# Altium schematic sheet MAIN.SchDoc
size A3; Organization: Electronic Research & Design; Address1: 11 Granofier; Address2: Zwartkop; Address3: Centurion; Address4: South Africa; Revision: 1; SheetNumber: 1; SheetTotal: 1; ProjectName: Flir
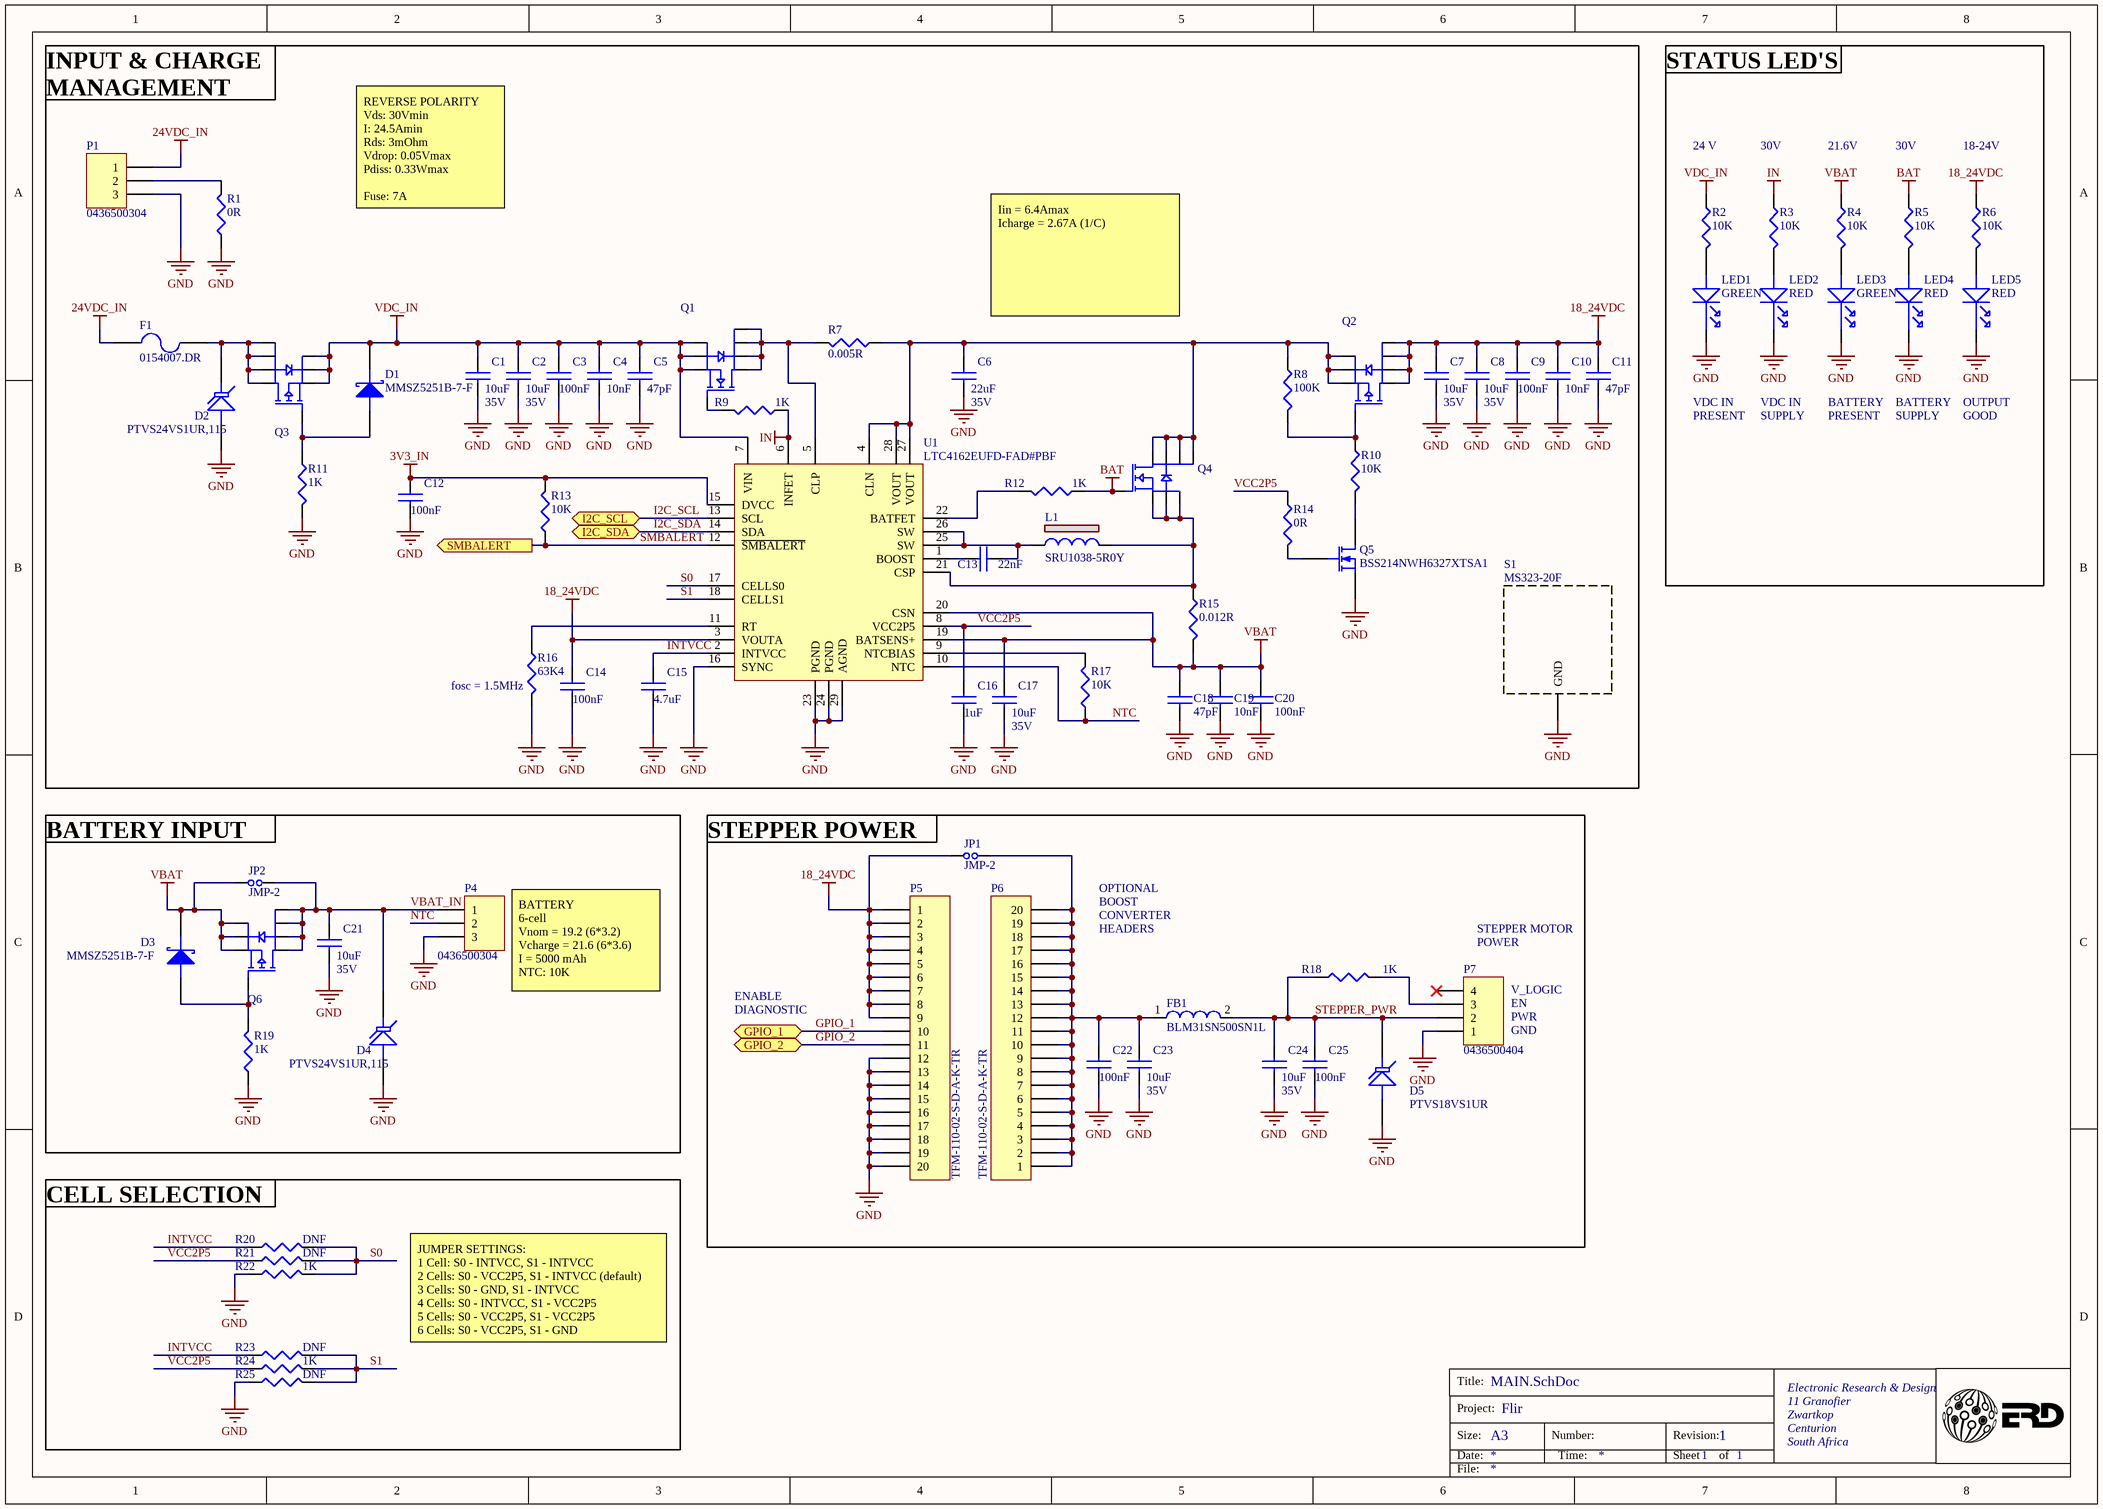
[diagram p0: MAIN.SchDoc]

## Parts
C1  10uF  Voltage Rating: 35V  [CC0805]
C2  10uF  Voltage Rating: 35V  [CC0805]
C3  100nF  [CC0402]
C4  10nF  [CC0402]
C5  47pF  [CC0402]
C6  22uF  Voltage Rating: 35V  [RC1206]
C7  10uF  Voltage Rating: 35V  [CC0805]
C8  10uF  Voltage Rating: 35V  [CC0805]
C9  100nF  [CC0402]
C10  10nF  [CC0402]
C11  47pF  [CC0402]
C12  100nF  [CC0402]
C13  22nF  [CC0402]
C14  100nF  [CC0402]
C15  4.7uF  [CC0603]
C16  1uF  [CC0402]
C17  10uF  Voltage Rating: 35V  [CC0805]
C18  47pF  [CC0402]
C19  10nF  [CC0402]
C20  100nF  [CC0402]
C21  10uF  Voltage Rating: 35V  [CC0805]
C22  100nF  [CC0402]
C23  10uF  Voltage Rating: 35V  [CC0805]
C24  10uF  Voltage Rating: 35V  [CC0805]
C25  100nF  [CC0402]
D1  MMSZ5251B-7-F  [SOD123W]
D2  PTVS24VS1UR,115  [SOD123W]
D3  MMSZ5251B-7-F  [SOD123W]
D4  PTVS24VS1UR,115  [SOD123W]
D5  PTVS18VS1UR  [SOD123W]
F1  0154007.DR  [OMNI_BLOK]
FB1  BLM31SN500SN1L  [RC1206]
JP1  JMP-2
JP2  JMP-2
L1  SRU1038-5R0Y  [MSS1260]
LED1  GREEN  [LED0603]
LED2  RED  [LED0603]
LED3  GREEN  [LED0603]
LED4  RED  [LED0603]
LED5  RED  [LED0603]
P1  0436500304  [HDR1X3]
P4  0436500304  [HDR1X3]
P5  TFM-110-02-S-D-A-K-TR  [HDR1X20]
P6  TFM-110-02-S-D-A-K-TR  [HDR1X20]
P7  0436500404  [HDR1X4]
Q1  BSC054N04NSGATMA1  [PG-TDSON-8 - alternate]  (value not drawn)
Q2  BSC030P03NS3GAUMA1  [PG-TDSON-8 - alternate]  (value not drawn)
Q3  BSC030P03NS3GAUMA1  [PG-TDSON-8 - alternate]  (value not drawn)
Q4  BSC054N04NSGATMA1  [PG-TDSON-8 - alternate]  (value not drawn)
Q5  BSS214NWH6327XTSA1  [SOT323]
Q6  BSC030P03NS3GAUMA1  [PG-TDSON-8 - alternate]  (value not drawn)
R1  0R  [RC0402]
R2  10K  [RC0402]
R3  10K  [RC0402]
R4  10K  [RC0402]
R5  10K  [RC0402]
R6  10K  [RC0402]
R7  0.005R  [RC1206W]
R8  100K  [RC0402]
R9  1K  [RC0402]
R10  10K  [RC0402]
R11  1K  [RC0402]
R12  1K  [RC0402]
R13  10K  [RC0402]
R14  0R  [RC0402]
R15  0.012R  [RC1206]
R16  63K4  [RC0402]
R17  10K  [RC0402]
R18  1K  [RC0402]
R19  1K  [RC0402]
R20  DNF  [RC0402]
R21  DNF  [RC0402]
R22  1K  [RC0402]
R23  DNF  [RC0402]
R24  1K  [RC0402]
R25  DNF  [RC0402]
S1  MS323-20F  [2118727-2]
U1  LTC4162EUFD-FAD#PBF  [QFN-28 LTC]

## Blocks framed on the sheet
fosc = 1.5MHz: C1-C20 D1 D2 F1 L1 P1 Q1-Q5 R1 R7-R17 S1 U1

## Ports
GPIO_1 (bidir), GPIO_2 (bidir), I2C_SCL (bidir), I2C_SDA (bidir), SMBALERT (out)

## Nets
3V3_IN: C12.1 R13.2 U1.15(DVCC)
18_24VDC: C7.1 C8.1 C9.1 C10.1 C11.1 C14.1 JP1.1 P5.1 P5.2 P5.3 P5.4 P5.5 P5.6 P5.7 P5.8 P5.9 Q2.5(DRAIN) Q2.6(DRAIN) Q2.7(DRAIN) Q2.8(DRAIN) R6.1 U1.3(VOUTA)
24VDC_IN: F1.1 P1.1
BAT: Q4.4(G) R5.1 R12.2
GND: C1.2 C2.2 C3.2 C4.2 C5.2 C6.2 C7.2 C8.2 C9.2 C10.2 C11.2 C12.2 C14.2 C15.2 C16.2 C17.2 C18.2 C19.2 C20.2 C21.2 C22.2 C23.2 C24.2 C25.2 D2.2 D4.2 D5.2 LED1.C LED2.C LED3.C LED4.C LED5.C P1.3 P4.3 P5.12 P5.13 P5.14 P5.15 P5.16 P5.17 P5.18 P5.19 P5.20 P7.1 Q5.3(S) R1.1 R11.2 R16.2 R19.2 R22.1 R25.1 S1.1(GND) U1.16(SYNC) U1.23(PGND) U1.24(PGND) U1.29(AGND)
IN: R3.1 R9.2 U1.6(INFET)
VBAT: C17.1 C18.1 C19.1 C20.1 D3.1 JP2.1 Q6.1(SOURCE) Q6.2(SOURCE) Q6.3(SOURCE) R4.1 R15.2 U1.19(BATSENS+) U1.20(CSN)
VDC_IN: C1.1 C2.1 C3.1 C4.1 C5.1 D1.1 Q1.1(S) Q1.2(S) Q1.3(S) Q3.1(SOURCE) Q3.2(SOURCE) Q3.3(SOURCE) R2.1 U1.7(VIN)
GPIO_1: P5.10 ; port GPIO_1
GPIO_2: P5.11 ; port GPIO_2
I2C_SCL: U1.13(SCL) ; port I2C_SCL
I2C_SDA: U1.14(SDA) ; port I2C_SDA
INTVCC: C15.1 R20.1 R23.1 U1.2(INTVCC)
NTC: P4.2 R17.1 U1.10(NTC)
S0: R20.2 R21.2 R22.2 U1.17(CELLS0)
S1: R23.2 R24.2 R25.2 U1.18(CELLS1)
SMBALERT: R13.1 U1.12(~{SMBALERT}) ; port SMBALERT
STEPPER_PWR: C24.1 C25.1 D5.1 FB1.2 P7.2 R18.1
VBAT_IN: C21.1 D4.1 JP2.2 P4.1 Q6.5(DRAIN) Q6.6(DRAIN) Q6.7(DRAIN) Q6.8(DRAIN)
VCC2P5: C16.1 R14.1 R21.1 R24.1 U1.8(VCC2P5)
NetC6_1: C6.1 Q2.1(SOURCE) Q2.2(SOURCE) Q2.3(SOURCE) Q4.5(D) Q4.6(D) Q4.7(D) Q4.8(D) R7.1 R8.1 U1.4(CLN) U1.27(VOUT) U1.28(VOUT)
NetC13_1: C13.1 U1.1(BOOST)
NetC13_2: C13.2 L1.1 U1.25(SW) U1.26(SW)
NetC22_1: C22.1 C23.1 FB1.1 JP1.2 P6.1 P6.2 P6.3 P6.4 P6.5 P6.6 P6.7 P6.8 P6.9 P6.10 P6.11 P6.12 P6.13 P6.14 P6.15 P6.16 P6.17 P6.18 P6.19 P6.20
NetD1_2: D1.2 Q3.4(GATE) R11.1
NetD2_1: D2.1 F1.2 Q3.5(DRAIN) Q3.6(DRAIN) Q3.7(DRAIN) Q3.8(DRAIN)
NetD3_2: D3.2 Q6.4(GATE) R19.1
NetL1_2: L1.2 Q4.1(S) Q4.2(S) Q4.3(S) R15.1 U1.21(CSP)
NetLED1_A: LED1.A R2.2
NetLED2_A: LED2.A R3.2
NetLED3_A: LED3.A R4.2
NetLED4_A: LED4.A R5.2
NetLED5_A: LED5.A R6.2
NetP1_2: P1.2 R1.2
NetP7_3: P7.3 R18.2
NetQ1_4: Q1.4(G) R9.1
NetQ1_5: Q1.5(D) Q1.6(D) Q1.7(D) Q1.8(D) R7.2 U1.5(CLP)
NetQ2_4: Q2.4(GATE) R8.2 R10.1
NetQ5_1: Q5.1(D) R10.2
NetQ5_2: Q5.2(G) R14.2
NetR12_1: R12.1 U1.22(BATFET)
NetR16_1: R16.1 U1.11(RT)
NetR17_2: R17.2 U1.9(NTCBIAS)

Not connected (* = marked no-connect by the designer): P7 4*

## Notes on the sheet
- INPUT & CHARGE MANAGEMENT
- STATUS LED'S
- 24 V
- 30V
- 21.6V
- 18-24V
- REVERSE POLARITY
  Vds: 30Vmin
  I: 24.5Amin
  Rds: 3mOhm
  Vdrop: 0.05Vmax
  Pdiss: 0.33Wmax
  Fuse: 7A
- Iin = 6.4Amax
  Icharge = 2.67A (1/C)
- VDC IN
- PRESENT
- SUPPLY
- BATTERY
- OUTPUT
- GOOD
- (near JP2) BATTERY INPUT
- (near JP1) STEPPER POWER
- OPTIONAL
- BOOST
- CONVERTER
- (near P4) BATTERY
  6-cell
  Vnom = 19.2 (6*3.2)
  Vcharge = 21.6 (6*3.6)
  I = 5000 mAh
  NTC: 10K
- HEADERS
- (near P7) POWER
- STEPPER MOTOR
- (near P7) V_LOGIC
- ENABLE
- DIAGNOSTIC
- (near P7) GND
- (near P7) PWR
- (near P7) EN
- CELL SELECTION
- JUMPER SETTINGS:
  1 Cell: S0 - INTVCC, S1 - INTVCC
  2 Cells: S0 - VCC2P5, S1 - INTVCC (default)
  3 Cells: S0 - GND, S1 - INTVCC
  4 Cells: S0 - INTVCC, S1 - VCC2P5
  5 Cells: S0 - VCC2P5, S1 - VCC2P5
  6 Cells: S0 - VCC2P5, S1 - GND
- Title:
- Size:
- Date:
- Project:
- A3
- Number:
- Time:
- Revision:
- Sheet
- of
- File:

## Library data of the parts
C1 C2 C7 C8 C17 C21 C23 C24 = CAP CER 0.1UF 10V 10% X5R 0402: CAP CER 10UF 35V 10% X5R 0805; Manufacturer: Murata; Part Number: GRM21BR6YA106KE43L; Package / Case: 0805
C3 C9 C12 C14 C20 C22 C25 = CAP CER 0.1UF 10V 10% X5R 0402: CAP CER 0.1UF 50V 10% X7R 0402; Manufacturer: Murata; Part Number: GCM155R71H104KE02D; Package / Case: 0402 (1005 Metric); Supplier: AAD
C4 C10 C19 = CAP CER 0.1UF 10V 10% X5R 0402: CAP CER 10NF 50V 10% X7R 0402; Manufacturer: Murata; Part Number: GRM155R71H103KA88J; Package / Case: 0402; Voltage Rating: 50V
C5 C11 C18 = CAP CER 0.1UF 10V 10% X5R 0402: CAP CER 47PF 50V 5% C0G/NP0 0402; Manufacturer: Murata; Part Number: GCM1555C1H470JA16D; Package / Case: 0402; Voltage Rating: 50V
C6 = CAP CER 0.1UF 10V 10% X5R 0402: CAP CER 22UF 35V 20% X5R 1206; Manufacturer: Murata; Part Number: C3216X5R1V226M160AC; Package / Case: 1206
C13 = CAP CER 0.1UF 10V 10% X5R 0402: CAP CER 0.022UF 50V 10% X7R 0402; Manufacturer: Murata; Part Number: GCM155R71H223KA55D; Package / Case: 0402 (1005 Metric); Supplier: AAD
C15 = CAP CER 0.1UF 10V 10% X5R 0402: CAP CER 4.7UF 25V 10% X5R 0603; Manufacturer: Murata; Part Number: GRM188R61E475KE11D; Package / Case: 0603; Supplier: AAD
C16 = CAP CER 0.1UF 10V 10% X5R 0402: CAP CER 1UF 10V 20% X5R 0402; Manufacturer: Murata; Part Number: GRM153R61A105ME95D; Package / Case: 0402 (1005 Metric); Supplier: AAD
D1 D3 = DIODE SCHOTTKY: DIODE, ZENER, 22V, 5%, 500mW, SOD123; PartNumber: MMSZ5251B-7-F
D2 D4 = Tranzorb: DIODE, TVS, 24V, 400W, SOD123W; PartNumber: PTVS24VS1UR,115
D5 = Tranzorb: DIODE, TVS, 24V, 400W, SOD123W; PartNumber: PTVS24VS1UR,115
F1 = Fuse 2: FUSE, OMNIBLOK, 125VAC/DC, 7A, Fast, SMD; Manufacturer: Littlefuse; Replacement Fuse: 0451007.MRL; PartNUmber: 0154007.DR
FB1 = FER_180_200_0: FERRITE, 12A, 1.6mOhm, 1206; PartNumber: BLM31SN500SN1L
JP1 JP2 = JMP-2: Solder Jumper 2 pin
L1 = MSS1260X: IND, Power, Shielded, 5uH, 4.8A Isat, 14.5 mOHM, SMD; Manufacturer: Bourns; PartNumber: SRU1038-5R0Y
LED1 LED3 = LED: LED, GRN, 65 mcd, 0603; PartNumber: LTST-C194KGKT; Color: GREEN
LED2 LED4 LED5 = LED: LED, GRN, 65 mcd, 0603; PartNumber: LTST-C194KRKT; Color: RED
P1 P4 = Header 3: Header, MicroFit, RA, 3-circuit, 3mm pitch, TH; Manufacturer: Molex; Mating Part: 0436450300; PartNumber: 0436500304
P5 P6 = Header 20: Header, 20 POS, 1.27mm PITCH, SMD; PartNumber: TFM-110-02-S-D-A-K-TR
P7 = Header 4: Header, MicroFit, RA, 4-circuit, 3mm pitch, TH; Manufacturer: Molex; Mating Part: 0436450400; PartNumber: 0436500404
Q1 Q4 = BSC190N15NS3: N-channel FET, 40V, 17A, 5.4mOhm, TDSON-8; pin to pad: 8>8+9; Part Number: BSC054N04NSGATMA1
Q2 Q3 Q6 = p_Channel: P-channel FET, 30V, 100A, 3mOhm, TDSON-8; Part Number: BSC030P03NS3GAUMA1
Q5 = MOSFET-N: N-Channel FET, 20V, 1.5A, 140mOhm, SOT323; pin to pad: 1>3 2>1 3>2; Published: 8-Jun-2000; LatestRevisionDate: 17-Jul-2002; LatestRevisionNote: Re-released for DXP Platform.; PackageVersion: 1995/1996; PackageReference: E3; Publisher: Altium Limited; PackageDescription: TO, Flat Index; 3 In-Line, Axial Leads; Body Dia. 4.6mm; Lead Dia. 0.5 mm (max); Part Number: BSS214NWH6327XTSA1
R1 R14 = RES_10K_1/16W_1%_0402: RES, 0 OHM, 1/16W, 1%, 0402; Manufacturer: Yageo; PartNumber: RC0402FR-070RL; Package / Case: 0402 (1005 Metric); Supplier: AAD
R2-R6 R10 R13 R17 = RES_10K_1/16W_1%_0402: RES, 10K OHM, 1/16W, 1%, 0402; Manufacturer: Yageo; Part Number: RC0402FR-0710KL; Package / Case: 0402 (1005 Metric); Supplier: AAD
R7 = RES_0_1/16W_1%_0402: RES, 0.005 OHM, 1W, 1%, 1206W; Manufacturer: Susumu; Manufacturer Part Number: KRL3216T4A-M-R005-F-T1; Package / Case: 1206 (3216 Metric); Supplier: DigiKey; Supplier Stock Code: 408-1969-2-ND; PartNumber: KRL3216T4A-M-R005-F-T1
R8 = RES_10K_1/16W_1%_0402: RES, 100K OHM, 1/16W, 1%, 0402; Manufacturer: Yageo; Part Number: RC0402FR-07100KL; Package / Case: 0402 (1005 Metric); Supplier: AAD
R9 R11 R12 R18 R19 = RES_10K_1/16W_1%_0402: RES, 1K OHM, 1/16W, 1%, 0402; Manufacturer: Yageo; PartNumber: RC0402FR-071KL; Package / Case: 0402 (1005 Metric); Supplier: AAD
R15 = RES_0_1/16W_1%_0402: RES, 0.012 OHM, 1W, 1%, 1206; Manufacturer: Panasonic; Manufacturer Part Number: ERJ-8CWFR010V; PartNumber: ERJ-8CWFR012V; Package / Case: 1206 (3216 Metric); Supplier: DigiKey; Supplier Stock Code: P0.012BVTR-ND
R16 = RES_10K_1/16W_1%_0402: RES, 63K4 OHM, 1/16W, 1%, 0402; Manufacturer: Yageo; Part Number: RC0402FR-0763K4L; Package / Case: 0402 (1005 Metric); Supplier: AAD
R20-R25 = RES_10K_1/16W_1%_0402: RES, 1K OHM, 1/16W, 1%, 0402; Manufacturer: Yageo; Part Number: RC0402FR-071KL; Package / Case: 0402 (1005 Metric); Supplier: AAD
S1 = BMI-S-206-F: RF Shield, 32.9mm x 24.4mm x 4.7mm; Mating Part: MS323-20C; PartNumber: MS323-20F
U1 = LTC4162: Multi-Cell LiFePO4 Charger, 35V, 3.2A, QFN-28; Part Number: LTC4162EUFD-FAD#PBF